# Altium schematic sheet Powersupply.SchDoc: Battery
size A4; SheetNumber: 1; SheetTotal: 3
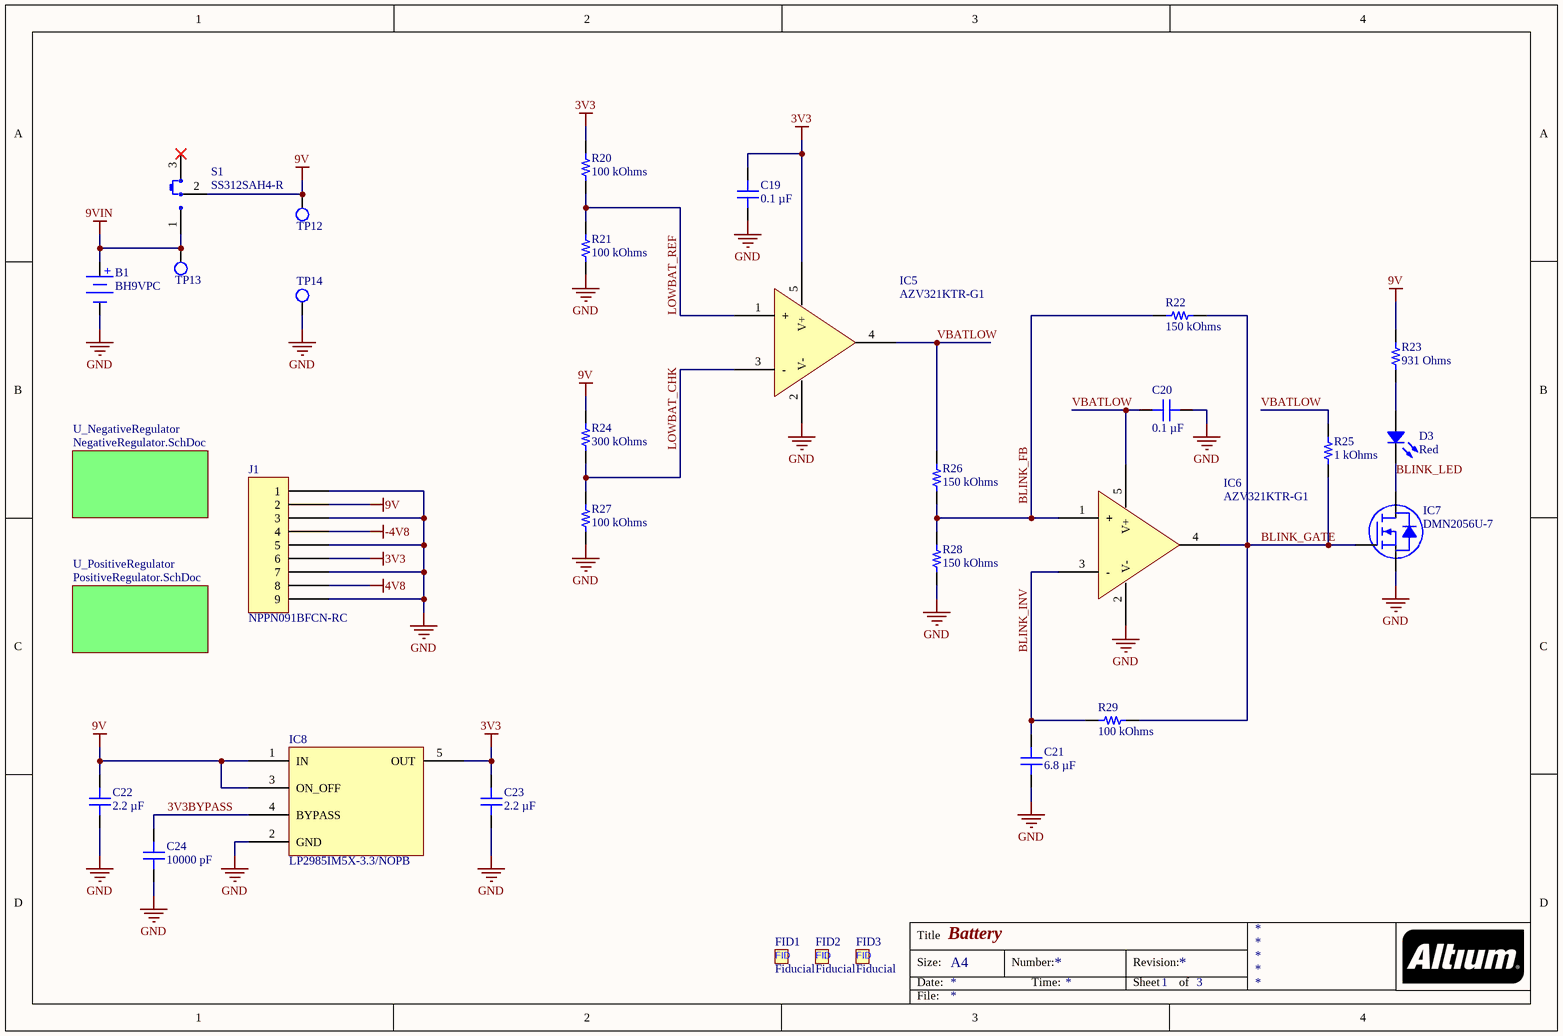
[diagram p0: Powersupply.SchDoc]

## Parts
B1  BH9VPC  [MPD BH9VPC]
C19  0.1 µF  [CAP 0603_1608]
C20  0.1 µF  [CAP 0603_1608]
C21  6.8 µF  [CAP 0805_2012]
C22  2.2 µF  [CAP 0805_2012]
C23  2.2 µF  [CAP 0805_2012]
C24  10000 pF  [CAP 0603_1608]
D3  Red  [LED 0805_2012 RED]
FID1  Fiducial  [Fiducial-1mm]
FID2  Fiducial  [Fiducial-1mm]
FID3  Fiducial  [Fiducial-1mm]
IC5  AZV321KTR-G1  [DIODES SOT-23-5 K]
IC6  AZV321KTR-G1  [DIODES SOT-23-5 K]
IC7  DMN2056U-7  [DIODES SOT-23-3]
IC8  LP2985IM5X-3.3/NOPB  [TI SOT-23-5 DBV]
J1  NPPN091BFCN-RC  [SULLINS NPPN091BFCN]
R20  100 kOhms  [RES 0603_1608]
R21  100 kOhms  [RES 0603_1608]
R22  150 kOhms  [RES 0603_1608]
R23  931 Ohms  [RES 0603_1608]
R24  300 kOhms  [RES 0603_1608]
R25  1 kOhms  [RES 0603_1608]
R26  150 kOhms  [RES 0603_1608]
R27  100 kOhms  [RES 0603_1608]
R28  150 kOhms  [RES 0603_1608]
R29  100 kOhms  [RES 0603_1608]
S1  SS312SAH4-R  [NKK SS312SAH4]
TP12  Test Point  [TestPoint-1.5mm]  (value not drawn)  (no BOM)
TP13  Test Point  [TestPoint-1.5mm]  (value not drawn)  (no BOM)
TP14  Test Point  [TestPoint-1.5mm]  (value not drawn)  (no BOM)

## Sub-sheets
U_NegativeRegulator = NegativeRegulator.SchDoc: no entries
U_PositiveRegulator = PositiveRegulator.SchDoc: no entries

## Nets
3V3: C19.2 C23.2 IC5.5(V+) IC8.5(OUT) J1.6 R20.2
4V8: J1.8
9V: C22.2 IC8.1(IN) IC8.3(ON_OFF) J1.2 R23.2 R24.2 S1.2(COM) TP12.1(TP)
9VIN: B1.1(+) S1.1 TP13.1(TP)
-4V8: J1.4
GND: B1.2(-) C19.1 C20.1 C21.1 C22.1 C23.1 C24.1 IC5.2(V-) IC6.2(V-) IC7.2(S) IC8.2(GND) J1.1 J1.3 J1.5 J1.7 J1.9 R21.1 R27.1 R28.1 TP14.1(TP)
3V3BYPASS: C24.2 IC8.4(BYPASS)
BLINK_FB: IC6.1(+) R22.2 R26.1 R28.2
BLINK_GATE: IC6.4(OUT) IC7.1(G) R22.1 R25.1 R29.2
BLINK_INV: C21.2 IC6.3(-) R29.1
BLINK_LED: D3.2 IC7.3(D)
LOWBAT_CHK: IC5.3(-) R24.1 R27.2
LOWBAT_REF: IC5.1(+) R20.1 R21.2
VBATLOW: C20.2 IC5.4(OUT) IC6.5(V+) R25.2 R26.2
NetD3_1: D3.1 R23.1

Not connected (* = marked no-connect by the designer): S1 3*

## Notes on the sheet
- Title
- Size:
- Date:
- A4
- Number:
- Time:
- Revision:
- Sheet
- of
- File:
- (in symbol CMP-002-000000-1) FID

## Library data of the parts
B1 = BH9VPC: BATT HOLDER 9V 1 CELL PC PIN; Manufacturer: MPD (Memory Protection Devices); Battery Type, Function: 9V, Holder; Number of Cells: 1; Style: Holder (Open); Part Number: BH9VPC; Battery Cell Size: 9V; ComponentLink1Description: Datasheet; ComponentLink1URL: http://www.memoryprotectiondevices.com/datasheets/BH9VPC-datasheet.pdf; ComponentLink2Description: DigiKey Link; ComponentLink2URL: https://www.digikey.com/en/products/detail/mpd-memory-protection-devices/BH9VPC/31510; Height Above Board: 0.812" (20.62mm); LastUpdated: 16/06/2022 08:46:57; Lifecycle Status: Active; Minimum Order: 1; Mounting Type: PCB, Through Hole; Packaging: Bulk; PartId: 3; Part Status: Active; Price: 1.07; Series: -; Supplier 1: DigiKey; Supplier Part Number 1: BH9V-PC-ND; Termination Style: PC Pin
C19 C20 = CL10B104KO8NNNC: CAP CER 0.1UF 16V X7R 0603; manufacturer: Samsung Electro-Mechanics; Tolerance: ±10%; Part Number: CL10B104KO8NNNC; Value: 0.1 µF; Applications: General Purpose; Capacitance: 0.1 µF; componentlink1description: Datasheet; componentlink1url: http://www.samsungsem.com/kr/support/product-search/mlcc/CL10B104KO8NNNC.jsp; componentlink2description: DigiKey Link; componentlink2url: https://www.digikey.com/en/products/detail/samsung-electro-mechanics/CL10B104KO8NNNC/3886663; Device Package: 0603 (1608 Metric); lastupdated: 19/06/2022 07:49:08; Lifecycle Status: Active; Minimum Order: 1; Mounting Type: Surface Mount, MLCC; Operating Temperature: -55°C ~ 125°C; Package / Case: 0603 (1608 Metric); packaging: TapeAndReel; partid: 9791; Part Status: Active; price: 0.01; series: CL; Size / Dimension: 0.063" L x 0.031" W (1.60mm x 0.80mm); Supplier 1: DigiKey; Supplier Part Number 1: 1276-1005-1-ND; Temperature Coefficient: X7R; Thickness (Max): 0.035" (0.90mm); Voltage - Rated: 16V
C21 = CGA4J1X7R0J685M125AC: CAP CER 6.8UF 6.3V X7R 0805; manufacturer: TDK Corporation; Tolerance: ±20%; Part Number: CGA4J1X7R0J685M125AC; Value: 6.8 µF; Applications: Automotive; Capacitance: 6.8 µF; componentlink1description: Datasheet; componentlink1url: https://product.tdk.com/info/en/catalog/datasheets/mlcc_automotive_general_en.pdf?ref_disty=digikey; componentlink2description: DigiKey Link; componentlink2url: https://www.digikey.com/en/products/detail/tdk-corporation/CGA4J1X7R0J685M125AC/3950014; Device Package: 0805 (2012 Metric); lastupdated: 20/06/2022 12:00:49; Lifecycle Status: Active; Minimum Order: 1; Mounting Type: Surface Mount, MLCC; Operating Temperature: -55°C ~ 125°C; Package / Case: 0805 (2012 Metric); packaging: TapeAndReel; partid: 40932; Part Status: Active; price: 0.08; Ratings: AEC-Q200; series: CGA; Size / Dimension: 0.079" L x 0.049" W (2.00mm x 1.25mm); Supplier 1: DigiKey; Supplier Part Number 1: 445-12778-1-ND; Temperature Coefficient: X7R; Thickness (Max): 0.057" (1.45mm); Voltage - Rated: 6.3V
C22 C23 = GRM21BR71E225KE11L: CAP CER 2.2UF 25V X7R 0805; manufacturer: Murata Electronics; Tolerance: ±10%; Part Number: GRM21BR71E225KE11L; Value: 2.2 µF; Applications: General Purpose; Capacitance: 2.2 µF; componentlink1description: Datasheet; componentlink1url: https://search.murata.co.jp/Ceramy/image/img/A01X/G101/ENG/GRM21BR71E225KE11-01.pdf; componentlink2description: DigiKey Link; componentlink2url: https://www.digikey.com/en/products/detail/murata-electronics/GRM21BR71E225KE11L/6606096; Device Package: 0805 (2012 Metric); lastupdated: 19/06/2022 07:52:39; Lifecycle Status: Active; Minimum Order: 1; Mounting Type: Surface Mount, MLCC; Operating Temperature: -55°C ~ 125°C; Package / Case: 0805 (2012 Metric); packaging: TapeAndReel; partid: 7355; Part Status: Active; price: 0.03; series: GRM; Size / Dimension: 0.079" L x 0.049" W (2.00mm x 1.25mm); Supplier 1: DigiKey; Supplier Part Number 1: 490-14467-1-ND; Temperature Coefficient: X7R; Thickness (Max): 0.055" (1.40mm); Voltage - Rated: 25V
C24 = 0603B103K500CT: CAP CER 10000PF 50V X7R 0603; manufacturer: Walsin Technology Corporation; Tolerance: ±10%; Part Number: 0603B103K500CT; Value: 10000 pF; Applications: General Purpose; Capacitance: 10000 pF; componentlink1description: Datasheet; componentlink1url: http://www.passivecomponent.com/wp-content/uploads/2018/10/MLCC.pdf; componentlink2description: DigiKey Link; componentlink2url: https://www.digikey.com/en/products/detail/walsin-technology-corporation/0603B103K500CT/9354883; Device Package: 0603 (1608 Metric); lastupdated: 20/06/2022 11:57:59; Lifecycle Status: Active; Minimum Order: 1; Mounting Type: Surface Mount, MLCC; Operating Temperature: -55°C ~ 125°C; Package / Case: 0603 (1608 Metric); packaging: TapeAndReel; partid: 16999; Part Status: Active; price: 0.01; series: -; Size / Dimension: 0.063" L x 0.031" W (1.60mm x 0.80mm); Supplier 1: DigiKey; Supplier Part Number 1: 1292-1386-1-ND; Temperature Coefficient: X7R; Thickness (Max): 0.034" (0.87mm); Voltage - Rated: 50V
D3 = APT2012SURCK: LED RED CLEAR CHIP SMD; Manufacturer: Kingbright; Configuration: Standard; Current - Test: 20mA; Lens Color: Colorless; Lens Size: 1.30mm x 1.25mm; Lens Style: Rectangle with Flat Top; Millicandela Rating: 80mcd; Viewing Angle: 120°; Voltage - Forward (Vf) (Typ): 1.95V; Wavelength - Dominant: 630nm; Wavelength - Peak: 645nm; Part Number: APT2012SURCK; Color: Red; ComponentLink1Description: Datasheet; ComponentLink1URL: http://www.kingbrightusa.com/images/catalog/SPEC/APT2012SURCK.pdf; ComponentLink2Description: DigiKey Link; ComponentLink2URL: https://www.digikey.com/en/products/detail/kingbright/APT2012SURCK/1747532; Device Package: 0805 (2012 Metric); Height (Max): 0.75mm; LastUpdated: 20/06/2022 12:31:40; Lens Transparency: Clear; Lifecycle Status: Active; Minimum Order: 1; Mounting Type: Surface Mount; Package / Case: 0805 (2012 Metric); Packaging: TapeAndReel; PartId: 356; Part Status: Active; Price: 0.05; Series: -; Size / Dimension: 2.00mm L x 1.25mm W; Supplier 1: DigiKey; Supplier Part Number 1: 754-1133-1-ND; Supplier Device Package: Chip LED; Value: Red
FID1-FID3 = CMP-002-000000-1: Design Item ID: Fiducial; Component Type: Standard; Source: Fiducial.SchLib; Pin Count: 0
IC5 IC6 = AZV321KTR-G1: IC OPAMP GP 1 CIRCUIT SOT23-5; Manufacturer: Diodes Incorporated; Amplifier Type: General Purpose; Current - Input Bias: 250 nA; Current - Output / Channel: 160 mA; Current - Supply: 130µA; Gain Bandwidth Product: 1 MHz; Number of Circuits: 1; Output Type: Rail-to-Rail; Slew Rate: 1V/µs; Voltage - Input Offset: 1.7 mV; Voltage - Supply, Single/Dual (±): 2.7V ~ 5.5V; Part Number: AZV321KTR-G1; ComponentLink1Description: Datasheet; ComponentLink1URL: https://www.diodes.com/assets/Datasheets/AZV321.pdf; ComponentLink2Description: DigiKey Link; ComponentLink2URL: https://www.digikey.com/en/products/detail/diodes-incorporated/AZV321KTR-G1/4471050; LastUpdated: 21/06/2022 12:26:19; Lifecycle Status: Active; Minimum Order: 1; Mounting Type: Surface Mount; Operating Temperature: -40°C ~ 85°C; Package / Case: SC-74A, SOT-753; Packaging: TapeAndReel; PartId: 42; Part Status: Active; Price: 0.11; Series: -; Supplier 1: DigiKey; Supplier Part Number 1: AZV321KTR-G1DICT-ND; Supplier Device Package: SOT-23-5
IC7 = DMN2056U-7: MOSFET N-CHANNEL 20V 4A SOT23-3; Manufacturer: Diodes Incorporated; Current - Continuous Drain (Id) @ 25°C: 4A (Ta); Drive Voltage (Max Rds On,  Min Rds On): 1.5V, 4.5V; Gate Charge (Qg) (Max) @ Vgs: 4.3 nC @ 4.5 V; Input Capacitance (Ciss) (Max) @ Vds: 339 pF @ 10 V; Power Dissipation (Max): 940mW; Rds On (Max) @ Id, Vgs: 38mOhm @ 3.6A, 4.5V; Vgs (Max): ±8V; Vgs(th) (Max) @ Id: 1V @ 250µA; Part Number: DMN2056U-7; ComponentLink1Description: Datasheet; ComponentLink1URL: https://www.diodes.com/assets/Datasheets/DMN2056U.pdf; ComponentLink2Description: DigiKey Link; ComponentLink2URL: https://www.digikey.com/en/products/detail/diodes-incorporated/DMN2056U-7/7352909; Drain to Source Voltage (Vdss): 20 V; FET Type: N-Channel; LastUpdated: 20/06/2022 12:38:07; Lifecycle Status: Active; Minimum Order: 1; Mounting Type: Surface Mount; Operating Temperature: -55°C ~ 150°C (TJ); Package / Case: TO-236-3, SC-59, SOT-23-3; Packaging: TapeAndReel; Part Status: Active; Price: 0.09; Series: -; Supplier 1: DigiKey; Supplier Part Number 1: DMN2056U-7DICT-ND; Supplier Device Package: SOT-23-3; Technology: MOSFET (Metal Oxide)
IC8 = LP2985IM5X-3.3/NOPB: IC REG LINEAR 3.3V 150MA SOT23-5; Manufacturer: Texas Instruments; Control Features: Enable; Current - Quiescent (Iq): 95 µA; Current - Supply (Max): 2.5 mA; Number of Regulators: 1; Output Configuration: Positive; Output Type: Fixed; Protection Features: Over Current, Over Temperature, Short Circuit; PSRR: 45dB (1kHz); Voltage Dropout (Max): 0.58V @ 150mA; Voltage - Input (Max): 16V; Part Number: LP2985IM5X-3.3/NOPB; ComponentLink1Description: Datasheet; ComponentLink1URL: http://www.ti.com/general/docs/suppproductinfo.tsp?distId=10&gotoUrl=http%3A%2F%2Fwww.ti.com%2Flit%2Fgpn%2Flp2985-n; ComponentLink2Description: DigiKey Link; ComponentLink2URL: https://www.digikey.com/en/products/detail/texas-instruments/LP2985IM5X-3-3-NOPB/367679; Current - Output: 150mA; LastUpdated: 21/06/2022 13:01:53; Lifecycle Status: Active; Minimum Order: 1; Mounting Type: Surface Mount; Operating Temperature: -40°C ~ 125°C; Package / Case: SC-74A, SOT-753; Packaging: TapeAndReel; Part Status: Active; Price: 0.45; Series: -; Supplier 1: DigiKey; Supplier Part Number 1: LP2985IM5X-3.3/NOPBCT-ND; Supplier Device Package: SOT-23-5; Voltage - Output (Min/Fixed): 3.3V
J1 = NPPN091BFCN-RC: CONN HDR 9POS 0.079 GOLD PCB; Manufacturer: Sullins Connector Solutions; Connector Type: Header; Contact Length - Post: 0.094" (2.40mm); Current Rating (Amps): 2A; Material Flammability Rating: UL94 V-0; Number of Positions: 9; Number of Positions Loaded: All; Pitch - Mating: 0.079" (2.00mm); Style: Board to Board; Part Number: NPPN091BFCN-RC; ComponentLink1Description: Datasheet; ComponentLink1URL: https://drawings-pdf.s3.amazonaws.com/10483.pdf; ComponentLink2Description: DigiKey Link; ComponentLink2URL: https://www.digikey.com/en/products/detail/sullins-connector-solutions/NPPN091BFCN-RC/804811; Contact Finish - Mating: Gold; Contact Finish - Post: Gold; Contact Finish Thickness - Mating: Flash; Contact Type: Female Socket; Fastening Type: Push-Pull; Insulation Color: Black; Insulation Height: 0.173" (4.40mm); LastUpdated: 21/06/2022 14:44:10; Lifecycle Status: Active; Minimum Order: 1; Mounting Type: Through Hole; Number of Rows: 1; Operating Temperature: -40°C ~ 105°C; Packaging: Tube; Part Status: Active; Price: 0.46; Series: -; Supplier 1: DigiKey; Supplier Part Number 1: S5751-09-ND; Termination: Solder
R20 R21 R27 R29 = RS73F1JTTD1003B: RES 100K OHM 0.1% 1/5W 0603; Manufacturer: KOA Speer Electronics, Inc.; Power (Watts): 0.2W, 1/5W; Temperature Coefficient: ±25ppm/°C; Part Number: RS73F1JTTD1003B; Value: 100 kOhms; ComponentLink1Description: Datasheet; ComponentLink1URL: http://www.koaspeer.com/pdfs/RS73.pdf; ComponentLink2Description: DigiKey Link; ComponentLink2URL: https://www.digikey.com/en/products/detail/koa-speer-electronics-inc/RS73F1JTTD1003B/11594402; Composition: Thick Film; Device Package: 0603 (1608 Metric); Features: Automotive AEC-Q200, Moisture Resistant; Height - Seated (Max): 0.022" (0.55mm); LastUpdated: 19/06/2022 08:07:20; Lifecycle Status: Active; Minimum Order: 1; Number of Terminations: 2; Operating Temperature: -55°C ~ 155°C; Package / Case: 0603 (1608 Metric); Packaging: TapeAndReel; PartId: 56386; Part Status: Active; Price: 0.08; Ratings: AEC-Q200; Resistance: 100 kOhms; Series: RS73; Size / Dimension: 0.063" L x 0.031" W (1.60mm x 0.80mm); Supplier 1: DigiKey; Supplier Part Number 1: 2019-RS73F1JTTD1003BCT-ND; Supplier Device Package: 0603; Tolerance: ±0.1%
R22 R26 R28 = RMCF0603FG150K: RES 150K OHM 1% 1/10W 0603; Manufacturer: Stackpole Electronics Inc; Power (Watts): 0.1W, 1/10W; Temperature Coefficient: ±100ppm/°C; Part Number: RMCF0603FG150K; Value: 150 kOhms; ComponentLink1Description: Datasheet; ComponentLink1URL: https://www.seielect.com/catalog/sei-rmcf_rmcp.pdf; ComponentLink2Description: DigiKey Link; ComponentLink2URL: https://www.digikey.com/en/products/detail/stackpole-electronics-inc/RMCF0603FG150K/1713634; Composition: Thick Film; Device Package: 0603 (1608 Metric); Features: Automotive AEC-Q200; Height - Seated (Max): 0.022" (0.55mm); LastUpdated: 20/06/2022 12:10:18; Lifecycle Status: Active; Minimum Order: 1; Number of Terminations: 2; Operating Temperature: -55°C ~ 155°C; Package / Case: 0603 (1608 Metric); Packaging: CutTape; PartId: 13982; Part Status: Active; Price: 0.01; Ratings: AEC-Q200; Resistance: 150 kOhms; Series: RMCF; Size / Dimension: 0.061" L x 0.031" W (1.55mm x 0.80mm); Supplier 1: DigiKey; Supplier Part Number 1: RMCF0603FG150KCT-ND; Supplier Device Package: 0603; Tolerance: ±1%
R23 = RK73H1JTTD9310F: RES 931 OHM 1% 1/8W 0603; Manufacturer: KOA Speer Electronics, Inc.; Power (Watts): 0.125W, 1/8W; Temperature Coefficient: ±100ppm/°C; Part Number: RK73H1JTTD9310F; Value: 931 Ohms; ComponentLink1Description: Datasheet; ComponentLink1URL: http://www.koaspeer.com/catimages/Products/RK73H/RK73H.pdf; ComponentLink2Description: DigiKey Link; ComponentLink2URL: https://www.digikey.com/en/products/detail/koa-speer-electronics-inc/RK73H1JTTD9310F/9845315; Composition: Thick Film; Device Package: 0603 (1608 Metric); Features: Automotive AEC-Q200, Moisture Resistant; Height - Seated (Max): 0.022" (0.55mm); LastUpdated: 20/06/2022 12:10:31; Lifecycle Status: Active; Minimum Order: 0; Number of Terminations: 2; Operating Temperature: -55°C ~ 155°C; Package / Case: 0603 (1608 Metric); PartId: 8605; Part Status: Active; Price: 0; Ratings: AEC-Q200; Resistance: 931 Ohms; Series: RK73H; Size / Dimension: 0.063" L x 0.031" W (1.60mm x 0.80mm); Supplier 1: DigiKey; Supplier Part Number 1: 2019-RK73H1JTTD9310FTR-ND; Supplier Device Package: 0603; Tolerance: ±1%
R24 = RC0603FR-07300KL: RES 300K OHM 1% 1/10W 0603; Manufacturer: Yageo; Power (Watts): 0.1W, 1/10W; Temperature Coefficient: ±100ppm/°C; Part Number: RC0603FR-07300KL; Value: 300 kOhms; ComponentLink1Description: Datasheet; ComponentLink1URL: https://www.yageo.com/upload/media/product/productsearch/datasheet/rchip/PYu-RC_Group_51_RoHS_L_10.pdf; ComponentLink2Description: DigiKey Link; ComponentLink2URL: https://www.digikey.com/en/products/detail/yageo/RC0603FR-07300KL/727145; Composition: Thick Film; Device Package: 0603 (1608 Metric); Features: Moisture Resistant; Height - Seated (Max): 0.022" (0.55mm); LastUpdated: 20/06/2022 12:10:33; Lifecycle Status: Active; Minimum Order: 1; Number of Terminations: 2; Operating Temperature: -55°C ~ 155°C; Package / Case: 0603 (1608 Metric); Packaging: CutTape; PartId: 7517; Part Status: Active; Price: 0.01; Resistance: 300 kOhms; Series: RC_L; Size / Dimension: 0.063" L x 0.031" W (1.60mm x 0.80mm); Supplier 1: DigiKey; Supplier Part Number 1: 311-300KHRCT-ND; Supplier Device Package: 0603; Tolerance: ±1%
R25 = RMCF0603FT1K00: RES 1K OHM 1% 1/10W 0603; Manufacturer: Stackpole Electronics Inc; Power (Watts): 0.1W, 1/10W; Temperature Coefficient: ±100ppm/°C; Part Number: RMCF0603FT1K00; Value: 1 kOhms; ComponentLink1Description: Datasheet; ComponentLink1URL: https://www.seielect.com/catalog/sei-rmcf_rmcp.pdf; ComponentLink2Description: DigiKey Link; ComponentLink2URL: https://www.digikey.com/en/products/detail/stackpole-electronics-inc/RMCF0603FT1K00/1761077; Composition: Thick Film; Device Package: 0603 (1608 Metric); Features: Automotive AEC-Q200; Height - Seated (Max): 0.022" (0.55mm); LastUpdated: 20/06/2022 12:09:49; Lifecycle Status: Active; Minimum Order: 1; Number of Terminations: 2; Operating Temperature: -55°C ~ 155°C; Package / Case: 0603 (1608 Metric); Packaging: CutTape; PartId: 23839; Part Status: Active; Price: 0.01; Ratings: AEC-Q200; Resistance: 1 kOhms; Series: RMCF; Size / Dimension: 0.061" L x 0.031" W (1.55mm x 0.80mm); Supplier 1: DigiKey; Supplier Part Number 1: RMCF0603FT1K00CT-ND; Supplier Device Package: 0603; Tolerance: ±1%
S1 = SS312SAH4-R: SWITCH SLIDE SPDT 0.4VA 28V; Manufacturer: NKK Switches; Actuator Length: 2.00mm; Actuator Type: Standard; Contact Timing: Shorting (MBB); Current Rating (Amps): 0.4VA (AC/DC); Switch Function: On-On; Part Number: SS312SAH4-R; Circuit: SPDT; ComponentLink1Description: Datasheet; ComponentLink1URL: http://www.nkkswitches.com/pdf/SS3surfaceMount-1.pdf; ComponentLink2Description: DigiKey Link; ComponentLink2URL: http://digikey.com/product-detail/en/nkk-switches/SS312SAH4-R/360-2924-1-ND/1051215; Contact Finish: Gold; Contact Material: Phosphor Bronze; LastUpdated: 04/01/2020 19:10:14; Lifecycle Status: Active; Minimum Order: 1; Mounting Type: Surface Mount, Right Angle; Operating Temperature: -25°C ~ 85°C; Packaging: TapeAndReel; PartId: 1; Part Status: Active; Price: 1.95; Series: SS3; Supplier 1: DigiKey; Supplier Part Number 1: 360-2924-1-ND; Termination Style: Gull Wing; Voltage Rating - AC: 28V; Voltage Rating - DC: 28V
TP12-TP14 = CMP-003-000000-1: Component Type: Standard (No BOM); Source: Test Point.SchLib; Design Item ID: Test Point; Pin Count: 1